# Altium schematic sheet a1_cover_page.SchDoc
size A4; Date: 1/11/16; CompanyName: AMTI; Engineer: JBayalas; DocumentNumber: 1; Revision: V1.0; SheetNumber: 1; SheetTotal: 11
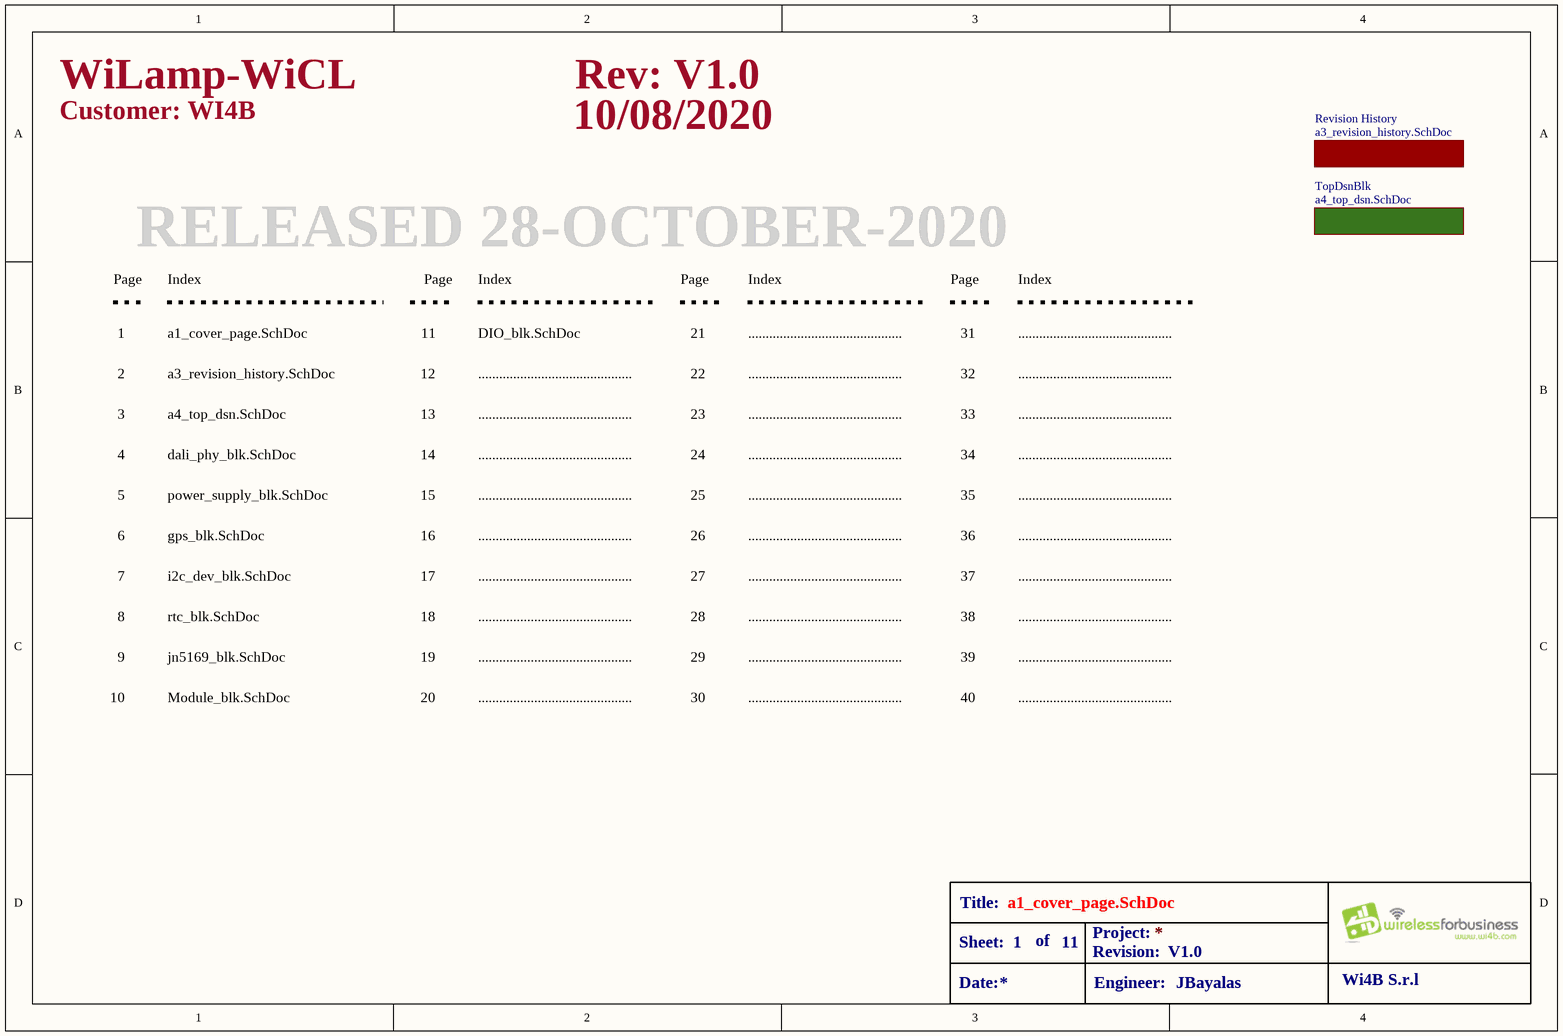
[diagram p0: a1_cover_page.SchDoc]

## Sub-sheets
Revision History = a3_revision_history.SchDoc: no entries
TopDsnBlk = a4_top_dsn.SchDoc: no entries

## Notes on the sheet
- WiLamp-WiCL
- Rev: V1.0
- Customer: WI4B
- 10/08/2020
- Page
- Index
- RELEASED 28-OCTOBER-2020
- 1
- 2
- a1_cover_page.SchDoc
- a3_revision_history.SchDoc
- 11
- 12
- ............................................
- DIO_blk.SchDoc
- 21
- 22
- 31
- 32
- 3
- a4_top_dsn.SchDoc
- 13
- 23
- 33
- 4
- 5
- dali_phy_blk.SchDoc
- power_supply_blk.SchDoc
- 14
- 15
- 24
- 25
- 34
- 35
- 6
- 7
- i2c_dev_blk.SchDoc
- gps_blk.SchDoc
- 16
- 17
- 26
- 27
- 36
- 37
- 8
- rtc_blk.SchDoc
- 18
- 28
- 38
- 9
- 10
- jn5169_blk.SchDoc
- Module_blk.SchDoc
- 19
- 20
- 29
- 30
- 39
- 40
- Title:
- Sheet:
- Date:
- of
- Project:
- Revision:
- Engineer:
- Wi4B S.r.l